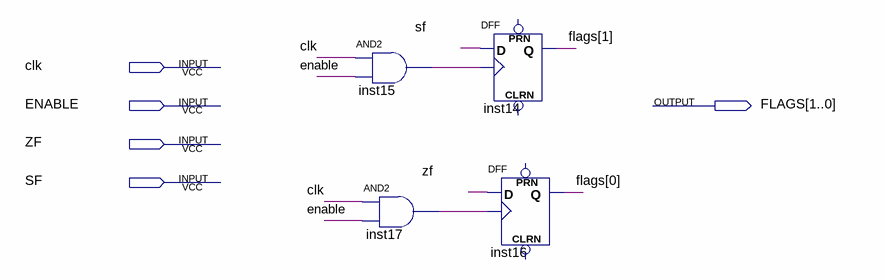
[diagram p0: schematic sheet]
// Quartus schematic FLAGS_BLOCK.bdf as structural Verilog: 4 symbols, 5 pins
module FLAGS_BLOCK (
  input  clk,
  input  ENABLE,
  input  ZF,
  input  SF,
  output [1:0] FLAGS
);

  wire inst15_out, inst17_out;

  and inst15 (inst15_out, clk, ENABLE);
  and inst17 (inst17_out, clk, ENABLE);
  DFF inst14 (.CLK(inst15_out), .D(SF), .Q(FLAGS[1]));  // open: CLRN, PRN
  DFF inst16 (.CLK(inst17_out), .D(ZF), .Q(FLAGS[0]));  // open: CLRN, PRN
endmodule
